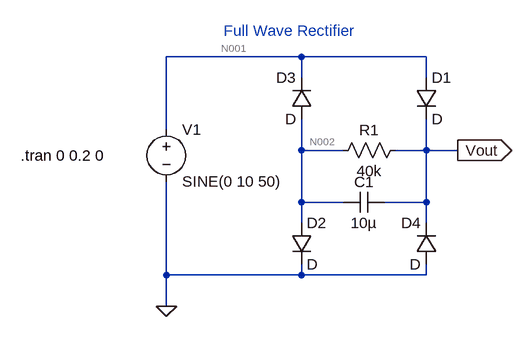
[diagram p0: schematic Full Wave Rectifier.asc]
Full Wave Rectifier.asc, the LTspice schematic file:
Version 4
SHEET 1 880 680
WIRE 160 64 -48 64
WIRE 352 64 160 64
WIRE 160 96 160 64
WIRE 352 96 352 64
WIRE -48 176 -48 64
WIRE 160 208 160 160
WIRE 224 208 160 208
WIRE 352 208 352 160
WIRE 352 208 304 208
WIRE 400 208 352 208
WIRE 160 288 160 208
WIRE 224 288 160 288
WIRE 352 288 352 208
WIRE 352 288 288 288
WIRE 160 320 160 288
WIRE 352 320 352 288
WIRE -48 400 -48 256
WIRE 160 400 160 384
WIRE 160 400 -48 400
WIRE 352 400 352 384
WIRE 352 400 160 400
WIRE -48 448 -48 400
FLAG -48 448 0
FLAG 400 208 Vout
IOPIN 400 208 Out
SYMBOL res 320 192 R90
WINDOW 0 0 56 VBottom 2
WINDOW 3 32 56 VTop 2
SYMATTR InstName R1
SYMATTR Value 40k
SYMBOL diode 336 96 R0
SYMATTR InstName D1
SYMBOL diode 144 320 R0
SYMATTR InstName D2
SYMBOL diode 176 160 R180
WINDOW 0 24 64 Left 2
WINDOW 3 24 0 Left 2
SYMATTR InstName D3
SYMBOL diode 368 384 R180
WINDOW 0 24 64 Left 2
WINDOW 3 24 0 Left 2
SYMATTR InstName D4
SYMBOL voltage -48 160 R0
WINDOW 123 24 124 Left 2
WINDOW 39 0 0 Left 0
SYMATTR InstName V1
SYMATTR Value SINE(0 10 50)
SYMBOL cap 288 272 R90
WINDOW 0 0 32 VBottom 2
WINDOW 3 32 32 VTop 2
SYMATTR InstName C1
SYMATTR Value 10µ
TEXT 40 24 Left 2 ;Full Wave Rectifier
TEXT -272 216 Left 2 !.tran 0 0.2 0

The netlist it stands for:
* Full Wave Rectifier.asc
R1 Vout N002 40k
D1 N001 Vout D
D2 N002 0 D
D3 N002 N001 D
D4 0 Vout D
V1 N001 0 SINE(0 10 50)
C1 Vout N002 10µ
.model D D
.lib standard.dio
* Full Wave Rectifier
.tran 0 0.2 0
.backanno
.end

* Results of the author's LTspice run, read from the files saved beside the schematic
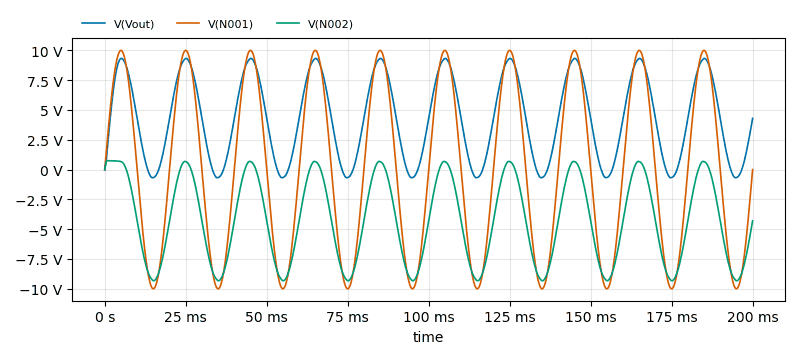
[diagram p1: Transient Analysis of Full Wave Rectifier.asc, plotted from the saved traces]
* Transient Analysis, 1 run:
*   V(Vout): min -683.5 mV, max 9.326 V, average 4.253 V, rms 5.526 V, last 4.295 V
*   V(N001): min -10 V, max 10 V, average -92.17 µV, rms 7.075 V, last 0 V
*   V(N002): min -9.326 V, max 743.8 mV, average -4.253 V, rms 5.557 V, last -4.295 V